# Altium schematic sheet Sheet1.SchDoc
size A4
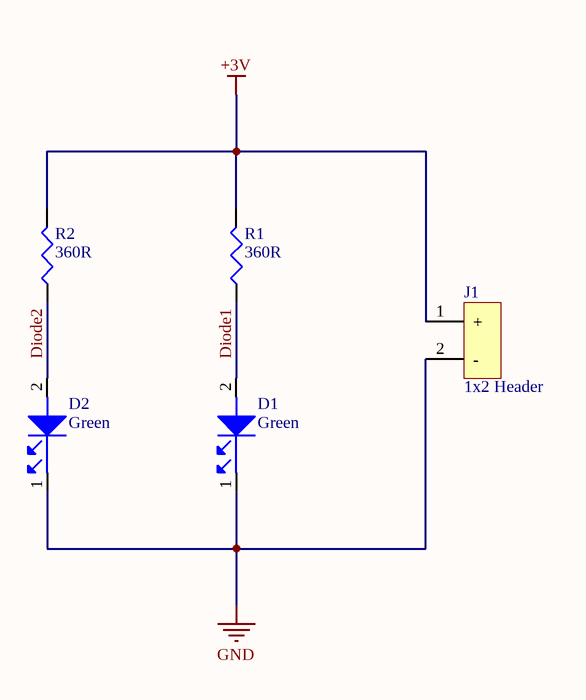
[diagram p0: Sheet1.SchDoc]

## Parts
D1  Green  [Resistor]
D2  Green  [Resistor]
J1  1x2 Header  [header 1x2]
R1  360R  [Resistor - duplicate]
R2  360R  [Resistor - duplicate]

## Nets
+3V: J1.1(+) R1.2 R2.2
GND: D1.1 D2.1 J1.2(-)
Diode1: D1.2 R1.1
Diode2: D2.2 R2.1

## Library data of the parts
D1 D2 = LTST-C191KGKT: LED Uni-Color Green 574nm 2-Pin Chip LED T/R; Manufacturer: Vishay Lite-On; Lens Color: Colorless; Power Rating: 75mW; Luminous Intensity: 35mcd; Viewing Angle: 130°; Lens Style: Rectangular,Colorless; Forward Current: 30mA; Forward Voltage: 2V; Dominant Wavelength: 571nm; Test Current: 20mA; Lens Transparency: Clear; Number of Elements: 1; Reverse Voltage: 5V; Category1: Optoelectronics; Supplier 1: Digi-Key; Supplier Part Number 1: 160-1446-1-ND; Manufacturer Part Number: LTST-C191KGKT; RoHS: Yes; Category: LEDs; Stock 1: 920505; Pricing 1: 1=0.26000, 10=0.14100, 100=0.06560, 500=0.06060, 1000=0.04747, 2000=0.04646 (USD); Mount: Surface Mount; Case/Package: 0603; Number of Pins: 2; Color: Green; Case Code (Metric): 1608; Case Code (Imperial): 0603; Min Operating Temperature: -55°C; Max Operating Temperature: 85°C; Packaging: Tape and Reel; Package Quantity: 1; Illumination Color: Green; Power Dissipation: 75mW; Wavelength: 574nm; Number of LEDs: 1; Max Power Dissipation: 75mW; Length: 1.6mm; Width: 0.8mm; Height: 0.55mm; Depth: 0.8mm; Radiation Hardening: No; Lead Free: Lead Free; RoHS Compliant: Yes; ComponentLink1URL: https://datasheet.ciiva.com/2109/ltst-c191kgkt-2109973.pdf?src-supplier=Digi-Key; ComponentLink1Description: https://datasheet.ciiva.com/2109/ltst-c191kgkt-2109973.pdf?src-supplier=Digi-Key
J1 = 22-27-2021: MOLEX - 22-27-2021 - WIRE-BOARD CONNECTOR HEADER 2 POSITION, 2.54MM; Contact Resistance: 20mR; Current Rating: 4A; Voltage Rating (AC): 250V; Voltage Rating: 500V; Number of Positions: 2; Insulation Resistance: 50GR; Gender: Male; Approvals: UL,CSA; Category1: Connectors; Supplier 1: Digi-Key; Manufacturer: Molex; Manufacturer Part Number: 22-27-2021; RoHS: Yes; Category: Headers and Wire Housings; Stock 1: 33075; Pricing 1: 1=0.26000, 10=0.21200, 100=0.15580, 1000=0.12390, 5000=0.10620, 10000=0.09912 (USD); Mount: Through Hole; Contact Plating: Tin; Contact Material: Tin; Color: White; Housing Color: Natural; Material: Nylon; Housing Material: Nylon; Weight: 0.00769oz; Min Operating Temperature: 0°C; Max Operating Temperature: 75°C; Number of Rows: 1; Package Quantity: 24000; Max Current Rating: 4A; Contact Gender: Male; Packaging: Bulk; Termination: Through Hole; Number of Contacts: 2; Number of Circuits: 2; Working Voltage: 250V; Orientation: Straight; Voltage Rating (DC): 250V; Series: 6410; Contact Type: -; Length: 10.16mm; Height: 11.7mm; Lead Pitch: 2.54mm; Pitch: 2.54mm; Depth: 5.8mm; Radiation Hardening: No; RoHS Compliant: Yes; REACH SVHC: Unknown; Lead Free: Lead Free; Flammability Rating: UL94 V-0; ComponentLink1URL: https://datasheet.ciiva.com/15217/getdatasheetpartid-163454-15217683.pdf?src-supplier=Verical; ComponentLink1Description: https://datasheet.ciiva.com/15217/getdatasheetpartid-163454-15217683.pdf?src-supplier=Verical; ComponentLink2URL: https://datasheet.ciiva.com/9468/0022272021-pcb-headers-9468403.pdf?src-supplier=Avnet; ComponentLink2Description: https://datasheet.ciiva.com/9468/0022272021-pcb-headers-9468403.pdf?src-supplier=Avnet; ComponentLink3URL: https://datasheet.ciiva.com/30177/113940022272021-pcb-headers-30177601.pdf?src-supplier=Onlinecomponents.com; ComponentLink3Description: https://datasheet.ciiva.com/30177/113940022272021-pcb-headers-30177601.pdf?src-supplier=Onlinecomponents.com; ComponentLink4URL: https://datasheet.ciiva.com/11746/0900766b804624e4-11746551.pdf?src-supplier=RSComponents; ComponentLink4Description: https://datasheet.ciiva.com/11746/0900766b804624e4-11746551.pdf?src-supplier=RSComponents; ComponentLink5URL: https://datasheet.ciiva.com/5154/0022272021-pcb-headers-227458-5154933.pdf?src-supplier=Mouser; ComponentLink5Description: https://datasheet.ciiva.com/5154/0022272021-pcb-headers-227458-5154933.pdf?src-supplier=Mouser; ComponentLink6URL: https://datasheet.ciiva.com/19462/879254-19462349.pdf?src-supplier=Jameco; ComponentLink6Description: https://datasheet.ciiva.com/19462/879254-19462349.pdf?src-supplier=Jameco; ComponentLink7URL: https://datasheet.ciiva.com/20207/22-0838e-20207111.pdf?src-supplier=Rapid+Electronics; ComponentLink7Description: https://datasheet.ciiva.com/20207/22-0838e-20207111.pdf?src-supplier=Rapid+Electronics; ComponentLink8URL: https://datasheet.ciiva.com/25908/0022272021-pcb-headers-25908245.pdf?src-supplier=Avnet+Europe; ComponentLink8Description: https://datasheet.ciiva.com/25908/0022272021-pcb-headers-25908245.pdf?src-supplier=Avnet+Europe; Supplier Part Number 1: WM4111-ND
R1 R2 = CRCW0805360RFKEAHP: RES SMD 360 OHM 1% 1/2W 0805; Manufacturer: Vishay Dale; Max Power Dissipation: 500mW; Temperature Coefficient: 100ppm/°C; Category1: Resistors; Supplier 1: Digi-Key; Supplier Part Number 1: CRCW0805360RFKEAHP-ND; Manufacturer Part Number: CRCW0805360RFKEAHP; RoHS: Yes; Category: Chip SMD Resistors; Stock 1: 5000; Pricing 1: 5000=0.03019, 10000=0.02818 (USD); Case/Package: 0805; Contact Plating: Tin; Min Operating Temperature: -55°C; Max Operating Temperature: 155°C; Package Quantity: 5000; Resistance: 360R; Tolerance: 1%; Packaging: Tape and Reel; Resistor Type: Thick Film; Number of Terminations: 2; Features: Automotive AEC-Q200; Series: CRCW-HP; Length: 0.079inch; Width: 0.049inch; Height: 0.024inch; Radiation Hardening: No; Lead Free: Lead Free; RoHS Compliant: Yes; ComponentLink1URL: https://datasheet.ciiva.com/2581/crcwhpe3-2581493.pdf?src-supplier=Digi-Key; ComponentLink1Description: https://datasheet.ciiva.com/2581/crcwhpe3-2581493.pdf?src-supplier=Digi-Key; ComponentLink2URL: https://datasheet.ciiva.com/8898/crcwhpe3-8898911.pdf?src-supplier=Avnet; ComponentLink2Description: https://datasheet.ciiva.com/8898/crcwhpe3-8898911.pdf?src-supplier=Avnet